# EAGLE design Logic probe (EAGLE 8.0.0)
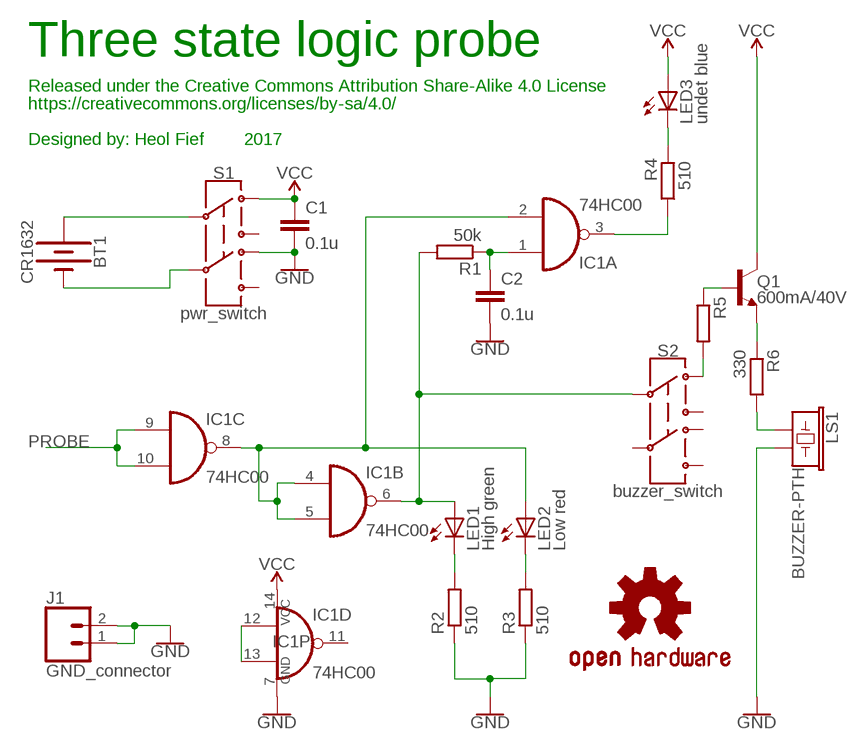
[diagram p0: schematic, sheet 1]

## Parts
BT1  CR1632  BATTERY-12MM_PTH  [BATTCON_12MM_PTH]
C1  0.1u  C-EUC0805  [C0805]
C2  0.1u  C-EUC0805  [C0805]
IC1  74HC00  74HC00D  [SO14]
J1  GND_connector  CONN_02POLAR  [MOLEX-1X2]
LED1  High green  LEDSMT1206  [1206]
LED2  Low red  LEDSMT1206  [1206]
LED3  undet blue  LEDSMT1206  [1206]
LOGO1  OSHW-LOGOL  [OSHW-LOGO-L]
LS1  BUZZER-PTH  [BUZZER-12MM]
Q1  600mA/40V  TRANS_NPN-MMBT2222AL  [SOT23-3]
R1  50k  R-EU_R1206  [R1206]
R2  510  R-EU_R0805  [R0805]
R3  510  R-EU_R0805  [R0805]
R4  510  R-EU_R0805  [R0805]
R5  R-EU_R1206  [R1206]
R6  330  R-EU_R1206  [R1206]
S1  pwr_switch  SWITCH-DPDT-SMD-AYZ0202  [SWITCH_DPDT_SMD_AYZ0202]
S2  buzzer_switch  SWITCH-DPDT-SMD-AYZ0202  [SWITCH_DPDT_SMD_AYZ0202]

## Nets
GND: C1.2 C2.2 IC1.7(P:GND) J1.1 J1.2 LS1.- R2.1 R3.1 S1.4
N$1: LED3.C R4.2
N$2: R5.2 S2.1
N$3: IC1.2(A:I1) IC1.4(B:I0) IC1.5(B:I1) IC1.8(C:O) LED2.A
N$4: Q1.1(B) R5.1
N$5: Q1.2(E) R6.1
N$6: LS1.+ R6.2
N$7: C2.1 IC1.1(A:I0) R1.1
N$8: LED1.C R2.2
N$9: IC1.3(A:O) R4.1
N$10: LED2.C R3.2
N$11: BT1.VCC@1(+) S1.2
N$12: BT1.GND(-) S1.5
N$13: IC1.12(D:I0) IC1.13(D:I1)
N$14: IC1.6(B:O) LED1.A R1.2 S2.2
PROBE: IC1.9(C:I0) IC1.10(C:I1)
VCC: C1.1 IC1.14(P:VCC) LED3.A Q1.3(C) S1.1
Unconnected: IC1.11(D:O) S1.3 S1.6 S2.3 S2.4 S2.5 S2.6

## Notes on the sheet
- Three state logic probe
- Released under the Creative Commons Attribution Share-Alike 4.0 License
- https://creativecommons.org/licenses/by-sa/4.0/
- Designed by: Heol Fief        2017

## Library data of the parts
BT1 = SparkFun-Batteries:BATTERY: Battery - Single Cell A variety of battery chemistries, sizes, and footprints. Device List: 20MM_PTH - Coin Cell Battery Holder - 20mm (PTH) <https://www.sparkfun.com/products/783> 12MM_SMD - Coin Cell Battery Holder - 12mm (SMD) <https://www.sparkfun.com/products/10592> 12MM_PTH - Coin Cell Battery Holder - 12mm (PTH) <https://www.sparkfun.com/products/7948> 20MM_SMD - 20mm Coin Cell Battery Holder (SMD) (2 legs) Used on the Big Time Watch Kit <https://www.sparkfun.com/products/11734> 20MM_SMD_4LEGS - Coin Cell Battery Holder - 20mm (SMD) <https://www.sparkfun.com/products/11892> 20MM_SMD_4LEGS_OVERPASTE - Coin Cell Battery Holder - 20mm (SMD) <https://www.sparkfun.com/products/11892> (Over-paste on the legs) 24.5MM_PTH - Coin Cell Battery Holder - 24.5mm (PTH) <https://www.sparkfun.com/products/8863> 9V - 9V Battery Holder - PC Mount Used on the SparkFun SparkPunk Sound Kit <https://www.sparkfun.com/products/11177> and SparkFun SparkPunk Sequencer Kit <https://www.sparkfun.com/products/12707> 18650 - Battery Holder - 18650 (PTH) <https://www.sparkfun.com/products/13113> AA - Battery Holder - 1xAA (PTH) <https://www.sparkfun.com/products/7949> AAA - Battery Holder - 1xAAA (PTH) <https://www.sparkfun.com/products/12718> AA_KIT - Battery Holder - 1xAA (PTH) <https://www.sparkfun.com/products/7949> Special kit package - pads only have exposed copper on one side of the board. AAA_KIT - Battery Holder - 1xAAA (PTH) <https://www.sparkfun.com/products/12718> Special kit package - pads only have exposed copper on one side of the board.; PROD_ID: BATT-08315; SF_SKU: PRT-07948
C1 C2 = rcl:C-EU: CAPACITOR, European symbol
IC1 = 74xx-eu:74*00: Quad 2-input NAND gate
J1 = SparkFun-Connectors:CONN_02: Multi connection point. Often used as Generic Header-pin footprint for 0.1 inch spaced/style header connections On any of the 0.1 inch spaced packages, you can populate with these: Break Away Headers - Straight <https://www.sparkfun.com/products/116> (PRT-00116) Break Away Male Headers - Right Angle <https://www.sparkfun.com/products/553> (PRT-00553) Female Headers <https://www.sparkfun.com/products/115> (PRT-00115) Break Away Headers - Machine Pin <https://www.sparkfun.com/products/117> (PRT-00117) Break Away Female Headers - Swiss Machine Pin <https://www.sparkfun.com/products/743> (PRT-00743) For SCREWTERMINALS and SPRING TERMINALS visit here: Screw Terimnals on SparkFun.com <https://www.sparkfun.com/search/results?term=Screw+Terminals> (5mm/3.5mm/2.54mm spacing) This device is also useful as a general connection point to wire up your design to another part of your project. Our various solder wires solder well into these plated through hole pads. Hook-Up Wire - Assortment (Stranded, 22 AWG) <https://www.sparkfun.com/products/11375> (PRT-11375) Hook-Up Wire - Assortment (Solid Core, 22 AWG) <https://www.sparkfun.com/products/11367> (PRT-11367) View the entire wire category on our website here <https://www.sparkfun.com/categories/141> Special notes: Molex polarized connector foot print use with: PRT-08233 with associated crimp pins and housings. 2.54_SCREWTERM for use with PRT-10571. 3.5mm Screw Terminal footprints for PRT-08084 5mm Screw Terminal footprints for use with PRT-08432; SF_ID: PRT-09918
LED1-LED3 = led:LED: LED OSRAM: - CHIPLED LG R971, LG N971, LY N971, LG Q971, LY Q971, LO R971, LY R971 LH N974, LH R974 LS Q976, LO Q976, LY Q976 LO Q996 - Hyper CHIPLED LW Q18S LB Q993, LB Q99A, LB R99A - SideLED LS A670, LO A670, LY A670, LG A670, LP A670 LB A673, LV A673, LT A673, LW A673 LH A674 LY A675 LS A676, LA A676, LO A676, LY A676, LW A676 LS A679, LY A679, LG A679 - Hyper Micro SIDELED® LS Y876, LA Y876, LO Y876, LY Y876 LT Y87S - SmartLED LW L88C, LW L88S LB L89C, LB L89S, LG L890 LS L89K, LO L89K, LY L89K LS L896, LA L896, LO L896, LY L896 - TOPLED LS T670, LO T670, LY T670, LG T670, LP T670 LSG T670, LSP T670, LSY T670, LOP T670, LYG T670 LG T671, LOG T671, LSG T671 LB T673, LV T673, LT T673, LW T673 LH T674 LS T676, LA T676, LO T676, LY T676, LB T676, LH T676, LSB T676, LW T676 LB T67C, LV T67C, LT T67C, LS T67K, LO T67K, LY T67K, LW E67C LS E67B, LA E67B, LO E67B, LY E67B, LB E67C, LV E67C, LT E67C LW T67C LS T679, LY T679, LG T679 LS T770, LO T770, LY T770, LG T770, LP T770 LB T773, LV T773, LT T773, LW T773 LH T774 LS E675, LA E675, LY E675, LS T675 LS T776, LA T776, LO T776, LY T776, LB T776 LHGB T686 LT T68C, LB T68C - Hyper Mini TOPLED® LB M676 - Mini TOPLED Santana® LG M470 LS M47K, LO M47K, LY M47K Source: http://www.osram.convergy.de LUXEON: - LUMILED® LXK2-PW12-R00, LXK2-PW12-S00, LXK2-PW14-U00, LXK2-PW14-V00 LXK2-PM12-R00, LXK2-PM12-S00, LXK2-PM14-U00 LXK2-PE12-Q00, LXK2-PE12-R00, LXK2-PE12-S00, LXK2-PE14-T00, LXK2-PE14-U00 LXK2-PB12-K00, LXK2-PB12-L00, LXK2-PB12-M00, LXK2-PB14-N00, LXK2-PB14-P00, LXK2-PB14-Q00 LXK2-PR12-L00, LXK2-PR12-M00, LXK2-PR14-Q00, LXK2-PR14-R00 LXK2-PD12-Q00, LXK2-PD12-R00, LXK2-PD12-S00 LXK2-PH12-R00, LXK2-PH12-S00 LXK2-PL12-P00, LXK2-PL12-Q00, LXK2-PL12-R00 Source: www.luxeon.com KINGBRIGHT: KA-3528ASYC Source: www.kingbright.com
LOGO1 = SparkFun-Aesthetics:OSHW-LOGO: Open-Source Hardware (OSHW) Logo This logo indicates the piece of hardware it is found on incorporates a OSHW license and/or adheres to the definition of open source hardware found here: http://freedomdefined.org/OSHW
LS1 = SparkFun-Electromechanical:BUZZER: Buzzer Small round buzzers that operate around the audible 2kHz range. You can use these as speakers to create simple music or user interfaces. Variant Overview: PTH - Mini Speaker - PC Mount 12mm 2.048kHz <https://www.sparkfun.com/products/7950> PTH_KIT - Mini Speaker - PC Mount 12mm 2.048kHz <https://www.sparkfun.com/products/7950> KIT simplifies soldering by adding stop mask to one side of the pads. PTH_NO_SILK - Mini Speaker - PC Mount 12mm 2.048kHz <https://www.sparkfun.com/products/7950> No silkscreen indicator of buzzer outline. PTH_KIT_NO_SILK - Mini Speaker - PC Mount 12mm 2.048kHz <https://www.sparkfun.com/products/7950> KIT package w/o silkscreen SMD - Buzzer Audio Magnetic (CCV-084B16) SMD buzzer used on, e.g. the LilyPad Buzzer <https://www.sparkfun.com/products/8463> and RFID USB Reader <https://www.sparkfun.com/products/9963>. SMD_KIT - Buzzer Audio Magnetic (CCV-084B16) SMD Buzzer with elongated pins to make soldering easier. Used on the SparkFun Simon Says - Surface Mount Soldering Kit <https://www.sparkfun.com/products/10935>.; PROD_ID: COMP-08253; SF_SKU: COM-07950
Q1 = SparkFun-DiscreteSemi:TRANS_NPN: NPN transistor Current controlled devices typically used to amplify current or used as a switch. BC547 - COM-08928 <http://www.sparkfun.com/products/8928> (TO-92 45V 100mA) (1.Collector 2.Base 3.Emitter) 2N3904 - COM-00521 <http://www.sparkfun.com/products/521> (TO-92 40V 200mA) (1.Emitter 2.Base 3.Collector) P2N2222A - COM-12852 <http://www.sparkfun.com/products/12852> (TO-92 40V 600mA) (1.Collector 2.Base 3.Emitter); PROD_ID: TRANS-08049
R1-R6 = resistor:R-EU_: RESISTOR, European symbol
S1 S2 = SparkFun-Switches:SWITCH-DPDT: Double-Pole, Double-Throw (DPDT) Switch Double-pole, double-throw switches. Variant Overview PTH-GPI-152-3013 Used on SparkFun Geiger Counter <https://www.sparkfun.com/products/11345> SMD-AY0202 Surface Mount DPDT Switch <https://www.sparkfun.com/products/597> (COM-00597) Used on e.g. LilyPad Arduino USB - ATmega32U4 Board <https://www.sparkfun.com/products/12049>; PROD_ID: SWCH-08179; SF_SKU: COM-00597

## Board
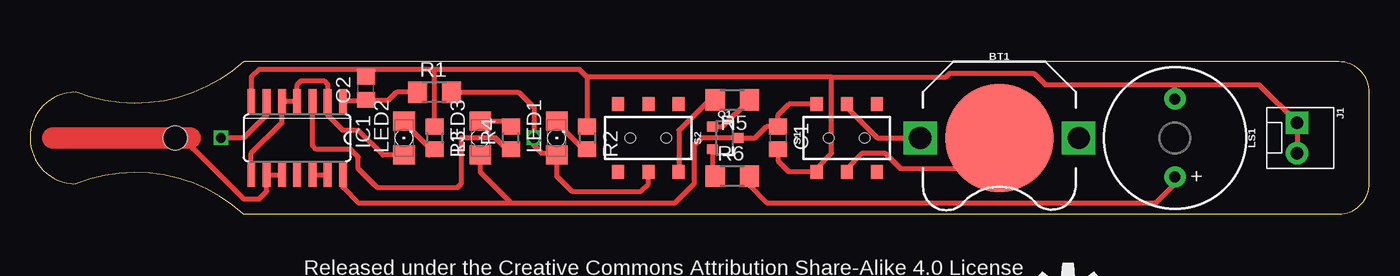
[diagram p1: board, top side]
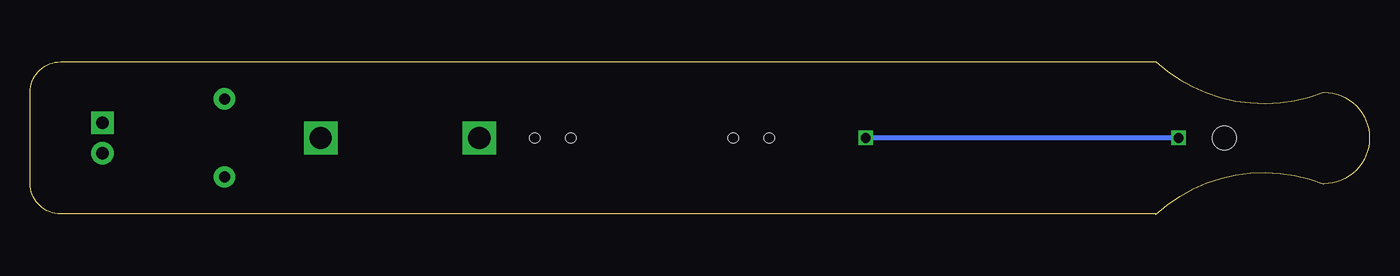
[diagram p2: board, bottom side, seen from below]

Size 111.43 x 12.7 mm. Coordinates in mm from the lower left corner, seen from the top.
Outline: 17.78,0.02 108.89,0.02 arc90 111.43,2.56 111.43,10.16 arc90 108.89,12.7 17.78,12.7 arc-63 3.81,10.16 arc180 3.81,2.54 arc-63 17.78,0
Copper layers (1*16): Top 0.035mm / dielectric 1.5mm / Bottom 0.035mm
Design rules "default": minimum track width 10mil, minimum drill 24mil, track to track 8mil, track to pad 8mil, pad to pad 8mil, via to via 8mil, smd to smd 8mil, copper to edge 40mil, drill to drill 8mil, minimum pad ring 10mil, minimum via ring 8mil, stop-mask expansion 4mil, vias tented up to drill 0mil, thermal gap 10mil
Holes 2 mm at 12.06,6.35

### Footprints (pad centres in the part's own frame; a part is rotated, then mirrored left to right if it is on the bottom)
BATTCON_12MM_PTH = smd 9 x 9: GND 0,0 | drill 1.854 square: VCC@1 6.604,0; VCC@2 -6.604,0
C0805 = smd 1.3 x 1.5: 1 -0.95,0; 2 0.95,0
SO14 = smd 0.66 x 2.032: 1 -3.81,-3.073; 2 -2.54,-3.073; 3 -1.27,-3.073; 4 0,-3.073; 5 1.27,-3.073; 6 2.54,-3.073; 7 3.81,-3.073; 8 3.81,3.073; 9 2.54,3.073; 10 1.27,3.073; 11 0,3.073; 12 -1.27,3.073; 13 -2.54,3.073; 14 -3.81,3.073
MOLEX-1X2 = drill 1.016 pad 1.88 square: 1 0,0 | drill 1.016 pad 1.88: 2 2.54,0
1206 = smd 1.6 x 1.803: A -1.422,0; C 1.422,0
BUZZER-12MM = drill 0.9 pad 1.778: + 3.25,0; - -3.25,0
SOT23-3 = smd 0.8 x 0.9: 1 -0.95,-1; 2 0.95,-1; 3 0,1.1
R1206 = smd 1.6 x 1.803: 1 -1.422,0; 2 1.422,0
R0805 = smd 1.3 x 1.5: 1 -0.95,0; 2 0.95,0
SWITCH_DPDT_SMD_AYZ0202 = smd 1 x 1.15: 1 -2.5,2.825; 2 0,2.825; 3 2.5,2.825; 4 -2.5,-2.825; 5 0,-2.825; 6 2.5,-2.825 | hole 0.85: 1.5,0; -1.5,0

### Placement (x,y rotation side)
BT1  80.64,6.35 180 top
C1  62.23,6.35 270 top
C2  27.94,10.48 90 top
IC1  22.22,6.35 180 top
J1  105.41,7.62 270 top
LED1  43.82,6.35 90 top
LED2  31.11,6.35 90 top
LED3  37.47,6.35 90 top
LOGO1  86.36,-7.62 0 top  (outside the outline)
LS1  95.25,6.35 270 top
Q1  57.79,6.35 270 top
R1  33.66,10.16 0 top
R2  46.36,6.35 270 top
R3  33.66,6.35 270 top
R4  40.01,6.35 90 top
R5  58.42,9.53 180 top
R6  58.42,3.17 0 top
S1  67.94,6.35 0 top
S2  51.44,6.35 180 top

### Tracks (layer width: path | path; a pad name or v marks a point on that pad's centre or on a via)
GND
  Top 0.406: 66.67,11.43 66.67,5.08 65.41,3.81 65.41,3.56 S1.4 63.15,3.52 62.23,4.45 C1.2 | 46.36,11.43 R2.1 | 66.67,11.43 46.36,11.43 | 46.36,11.43 45.72,12.06 33.66,12.06 | 66.67,11.43 76.2,11.43 76.52,11.75 83.5,11.75 84.45,10.79 95.25,10.79 | 95.25,10.79 102.23,10.79 J1.1 J1.2 | 33.66,12.06 27.94,12.06 | 27.94,12.06 19.05,12.06 18.41,11.43 IC1.7 | LS1.- 95.25,10.79 | R3.1 33.66,12.06 | C2.2 27.94,12.06
N$1
  Top 0.406: LED3.C 39.53,7.77 R4.2
N$2
  Top 0.406: R5.2 56.52,9.53 53.98,6.99 53.98,3.56 S2.1
N$3
  Top 0.406: IC1.8 18.41,5.08 20.95,7.62 IC1.5 IC1.4 22.22,10.79 22.54,11.11 24.45,11.11 24.77,10.79 IC1.2 24.77,8.26 26.04,6.99 27.3,6.99 29.36,4.93 LED2.A
N$4
  Top 0.406: Q1.1 57.62,7.3 R5.1
N$5
  Top 0.406: Q1.2 56.79,3.39 R6.1
N$6
  Top 0.406: LS1.+ 95.25,2.54 93.66,0.95 61.28,0.95 59.84,2.39 R6.2
N$7
  Top 0.406: R1.1 30.48,10.16 29.85,9.53 C2.1 27.73,9.42 IC1.1
N$8
  Top 0.406: LED1.C 43.82,7.62 45.72,5.71 46.04,5.71 R2.2 46.36,5.08
N$9
  Top 0.406: R4.1 39.69,5.71 39.37,5.71 38.74,6.35 35.88,6.35 35.88,2.54 35.56,2.22 28.89,2.22 27.3,3.81 27.3,4.76 26.67,5.4 23.81,5.4 23.5,5.71 IC1.3
N$10
  Top 0.406: 33.18,4.93 R3.2 33.34,5.71 33.02,5.71 31.11,7.62 LED2.C
N$11
  Top 0.406: S1.2 67.94,8.89 70.48,6.35 BT1.VCC@1
N$12
  Top 0.406: S1.5 67.94,3.81 69.21,5.08 71.12,5.08 72.39,3.81 80.64,3.81 BT1.GND
N$13
  Top 0.406: IC1.12 IC1.13
N$14  (via drill 0.8)
  Top 0.406: LED1.A 43.82,5.08 | LED1.A 43.66,5.08 42.55,5.08 41.91,5.71 v41.91,6.35 41.91,8.89 40.64,10.16 R1.2 | LED1.A 43.82,3.17 45.09,1.91 50.8,1.91 51.44,2.54 S2.2 | IC1.6 19.68,8.26 17.78,6.35 v15.88,6.35
  Bottom 0.406: v15.88,6.35 v41.91,6.35
PROBE
  Top 0.406: IC1.10 IC1.9 19.68,1.91 19.05,1.27 17.78,1.27 13.33,5.71 13.33,6.35
  Top 1.778: 13.33,6.35 1.91,6.35
VCC
  Top 0.406: LED3.A 37.47,3.49 40.01,0.95 | 26.04,2.54 IC1.14 26.04,2.22 27.3,0.95 40.01,0.95 | 40.01,0.95 53.66,0.95 55.25,2.54 55.25,5.71 55.88,6.35 Q1.3 60.33,6.35 61.28,7.3 C1.1 62.23,8.26 63.15,9.18 S1.1

### Text on the board
tPlace: + | Released under the Creative Commons Attribution Share-Alike 4.0 License | https://creativecommons.org/licenses/by-sa/4.0/ | Designed by: Heol Fief 2017